# EAGLE design Watch_timer (EAGLE 7.6.0)
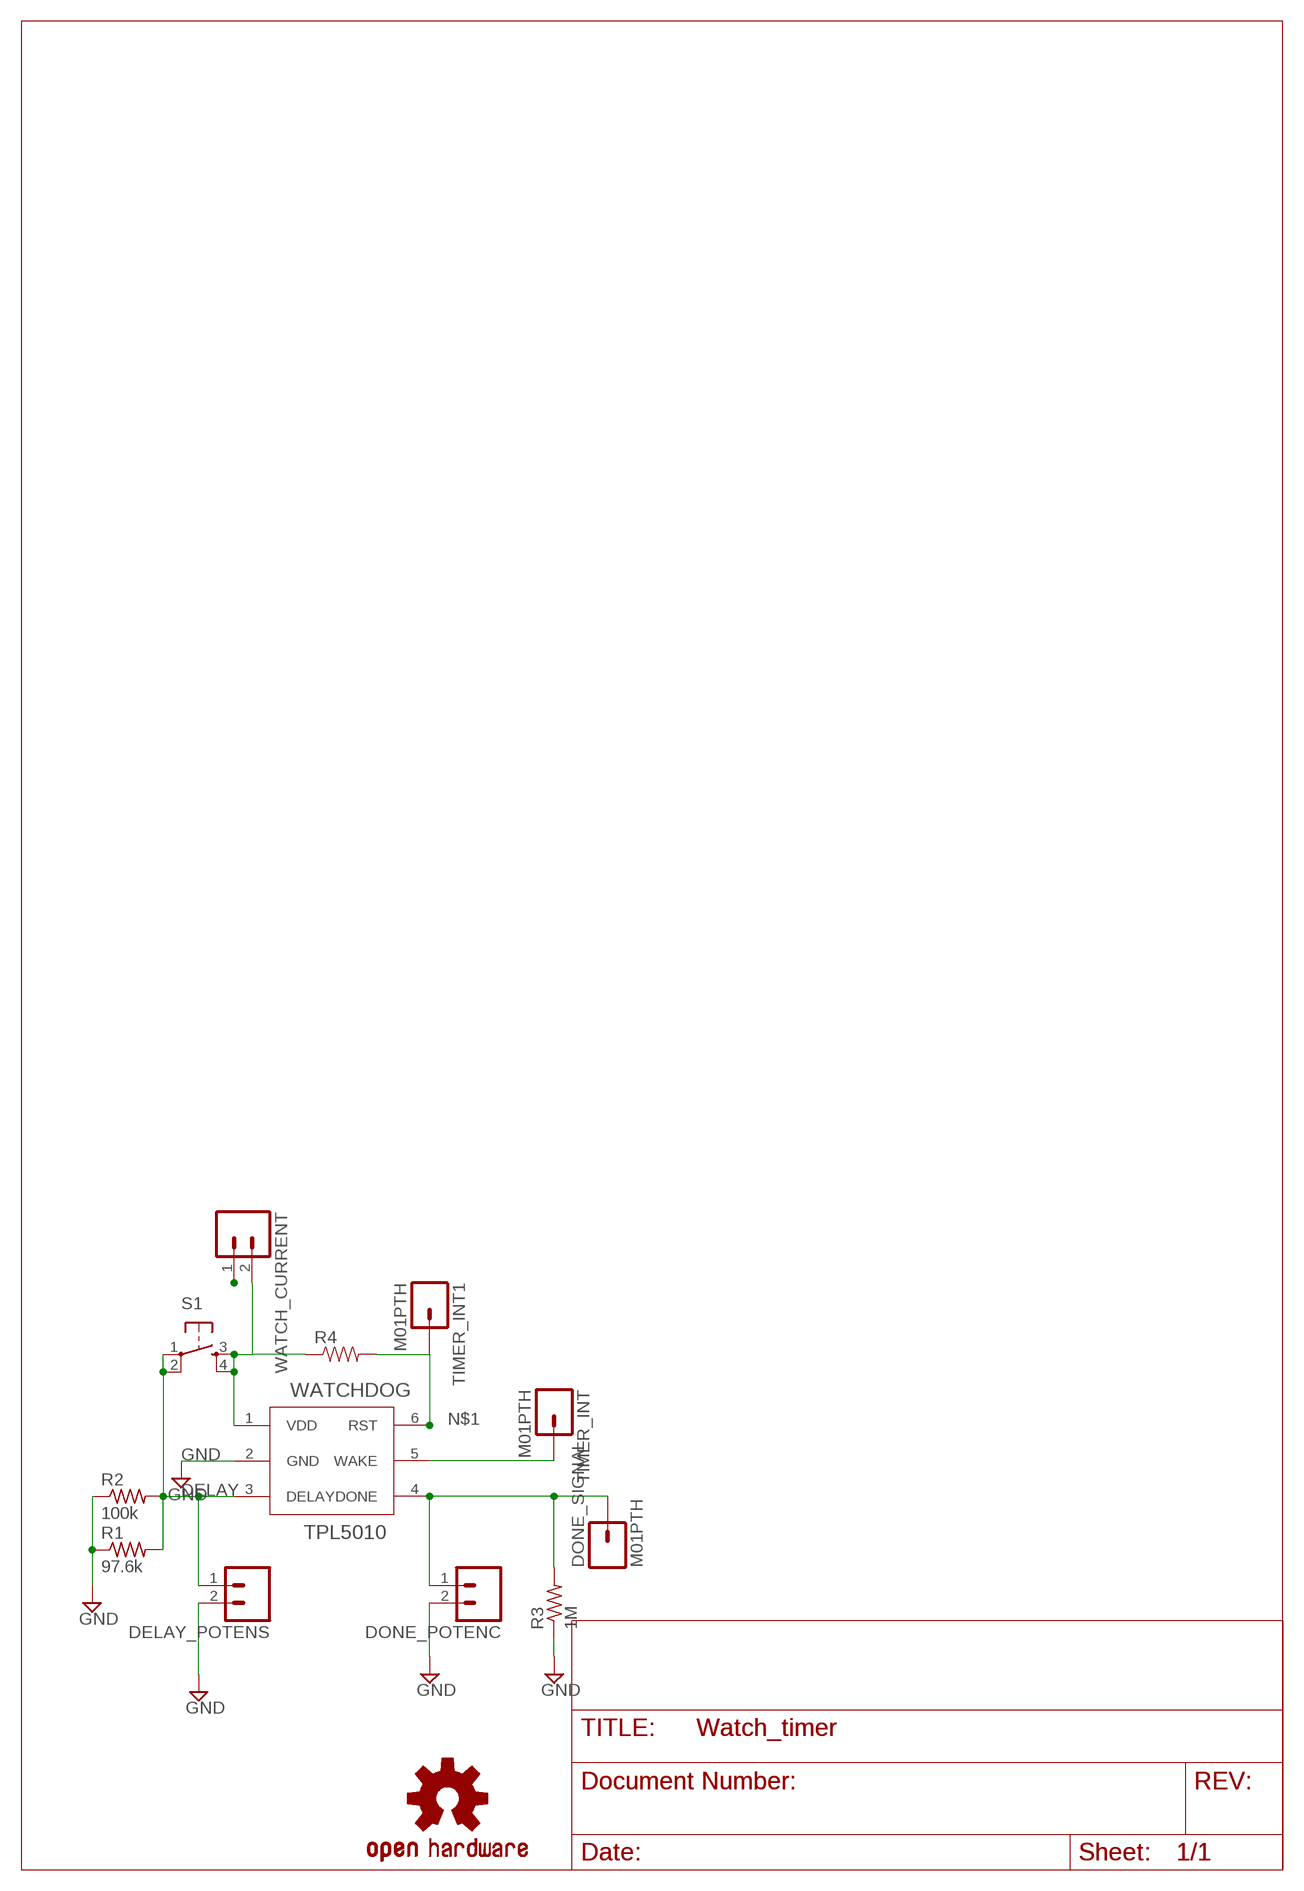
[diagram p0: schematic, sheet 1]

## Parts
DELAY_POTENS  M02PTH  [1X02]
DONE_POTENC  M02PTH  [1X02]
DONE_SIGNAL  M01PTH  [1X01]
LOGO1  OSHW-LOGOL  [OSHW-LOGO-L]
R1  97.6k  R-US_R0805  [R0805]
R2  100k  R-US_R0805  [R0805]
R3  1M  R-US_R0805  [R0805]
R4  RESISTOR0603-RES  [0603-RES]
S1  TAC_SWITCHSMD  [TACTILE_SWITCH_SMD]
TIMER_INT  M01PTH  [1X01]
TIMER_INT1  M01PTH  [1X01]
WATCH_CURRENT  M02PTH  [1X02]
WATCHDOG  TPL5010  [TSOT-23]

## Nets
DELAY: DELAY_POTENS.1 R1.2 R2.2 S1.1 S1.2 WATCHDOG.3(DELAY)
DONE: DONE_POTENC.1 DONE_SIGNAL.1 R3.2 WATCHDOG.4(DONE)
GND: DELAY_POTENS.2 DONE_POTENC.2 R1.1 R2.1 R3.1 WATCHDOG.2(GND)
N$1: R4.2 TIMER_INT1.1 WATCHDOG.6(RST)
N$2: TIMER_INT.1 WATCHDOG.5(WAKE)
VDD: WATCH_CURRENT.1
VDD_WATCH: R4.1 S1.3 S1.4 WATCH_CURRENT.2 WATCHDOG.1(VDD)

## Library data of the parts
DELAY_POTENS DONE_POTENC WATCH_CURRENT = SparkFun:M02: Header 2 Standard 2-pin 0.1" header. Use with straight break away headers (SKU : PRT-00116), right angle break away headers (PRT-00553), swiss pins (PRT-00743), machine pins (PRT-00117), and female headers (PRT-00115). Molex polarized connector foot print use with SKU : PRT-08233 with associated crimp pins and housings.
DONE_SIGNAL TIMER_INT TIMER_INT1 = SparkFun:M01: Header 1 Standard 1-pin 0.1" header. Use with straight break away headers (SKU : PRT-00116), right angle break away headers (PRT-00553), swiss pins (PRT-00743), machine pins (PRT-00117), and female headers (PRT-00115).
LOGO1 = SparkFun-Aesthetics:OSHW-LOGO: Open Source Hardware Logo This logo indicates the piece of hardware it is found on incorporates a OSHW license and/or adheres to the definition of open source hardware found here: http://freedomdefined.org/OSHW
R1-R3 = adafruit:R-US_: RESISTOR, American symbol
R4 = SparkFun:RESISTOR: Resistor Basic schematic elements and footprints for 0603, 1206, and PTH resistors.
S1 = SparkFun:TAC_SWITCH: Momentary Switch Button commonly used for reset or general input. Spark Fun Electronics SKU : COM-00097
WATCHDOG = Custom Components:TPL5010

## Board
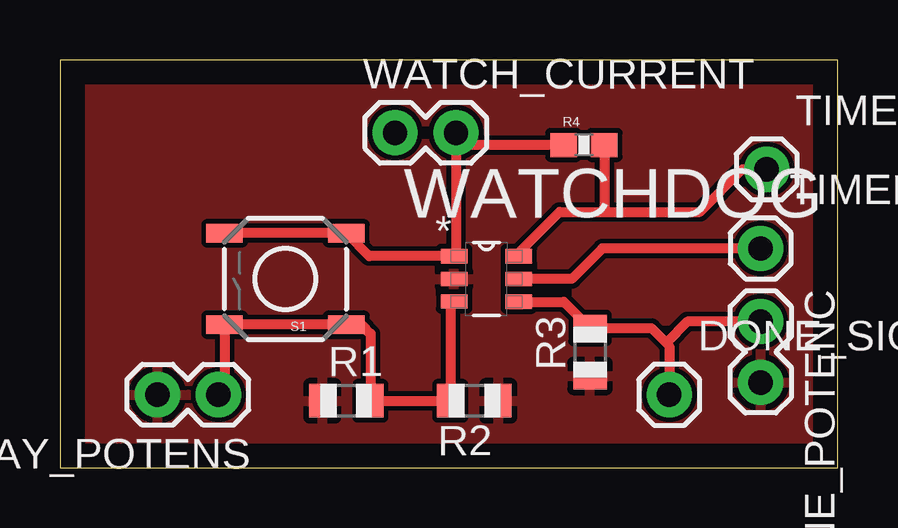
[diagram p1: board, top side]

Size 32.44 x 17.01 mm. Coordinates in mm from the lower left corner, seen from the top.
Outline: 0,0 32.44,0 32.44,17.01 0,17.01 0,0
Copper layers (1*16): Top 0.035mm / dielectric 1.5mm / Bottom 0.035mm
Design rules "default": minimum track width 10mil, minimum drill 24mil, track to track 8mil, track to pad 8mil, pad to pad 8mil, via to via 8mil, smd to smd 8mil, copper to edge 40mil, drill to drill 8mil, minimum pad ring 10mil, minimum via ring 8mil, stop-mask expansion 4mil, vias tented up to drill 0mil, thermal gap 10mil

### Footprints (pad centres in the part's own frame; a part is rotated, then mirrored left to right if it is on the bottom)
1X02 = drill 1.016 pad 1.88: 1 0,0; 2 2.54,0
1X01 = drill 1.016 pad 1.88: 1 0,0
R0805 = smd 1.1 x 1.4: 1 -1,0; 2 1,0
0603-RES = smd 1.1 x 1: 1 -0.85,0; 2 0.85,0
TACTILE_SWITCH_SMD = smd 1.524 x 0.762: 1 -2.54,1.905; 2 2.54,1.905; 3 -2.54,-1.905; 4 2.54,-1.905
TSOT-23 = smd 1.1 x 0.6: 1 -1.35,0.95; 2 -1.35,0; 3 -1.35,-0.94; 4 1.35,-0.95; 5 1.35,0; 6 1.35,0.95

### Placement (x,y rotation side)
DELAY_POTENS  6.6,3.05 180 top
DONE_POTENC  29.21,6.1 270 top
DONE_SIGNAL  25.4,3.05 0 top
LOGO1  8.89,30.48 0 top  (outside the outline)
R1  11.94,2.79 0 top
R2  17.27,2.79 180 top
R3  22.1,4.83 90 top
R4  21.84,13.46 0 top
S1  9.4,7.87 180 top
TIMER_INT  29.21,9.14 0 top
TIMER_INT1  29.46,12.45 0 top
WATCH_CURRENT  13.97,13.97 0 top
WATCHDOG  17.78,7.87 0 top

### Tracks (layer width: path | path; a pad name or v marks a point on that pad's centre or on a via)
DELAY
  Top 0.406: WATCHDOG.3 16.27,6.93 R2.2 R1.2 12.95,2.81 12.95,5.59 12.57,5.97 S1.1 S1.2 6.86,3.3 DELAY_POTENS.1
DONE
  Top 0.406: WATCHDOG.4 21,6.92 R3.2 24.65,5.83 25.27,5.21 | 25.27,5.21 25.4,5.08 DONE_SIGNAL.1 | DONE_POTENC.1 26.16,6.1 25.27,5.21
GND
  pour Top: -5.08,81.28 -5.08,-2.54 102.87,-2.54 102.87,83.82 -5.08,83.82
N$1
  Top 0.406: WATCHDOG.6 19.13,8.97 20.83,10.67 22.86,10.67 | 22.86,10.67 26.67,10.67 28.45,12.45 TIMER_INT1.1 | R4.2 22.69,10.83 22.86,10.67
N$2
  Top 0.406: TIMER_INT.1 22.61,9.14 21.34,7.87 WATCHDOG.5
VDD_WATCH
  Top 0.406: S1.4 S1.3 12.89,8.82 WATCHDOG.1 16.51,8.9 WATCH_CURRENT.2 17.02,13.46 R4.1